# EasyEDA Pro project ax08.eprj, board mem
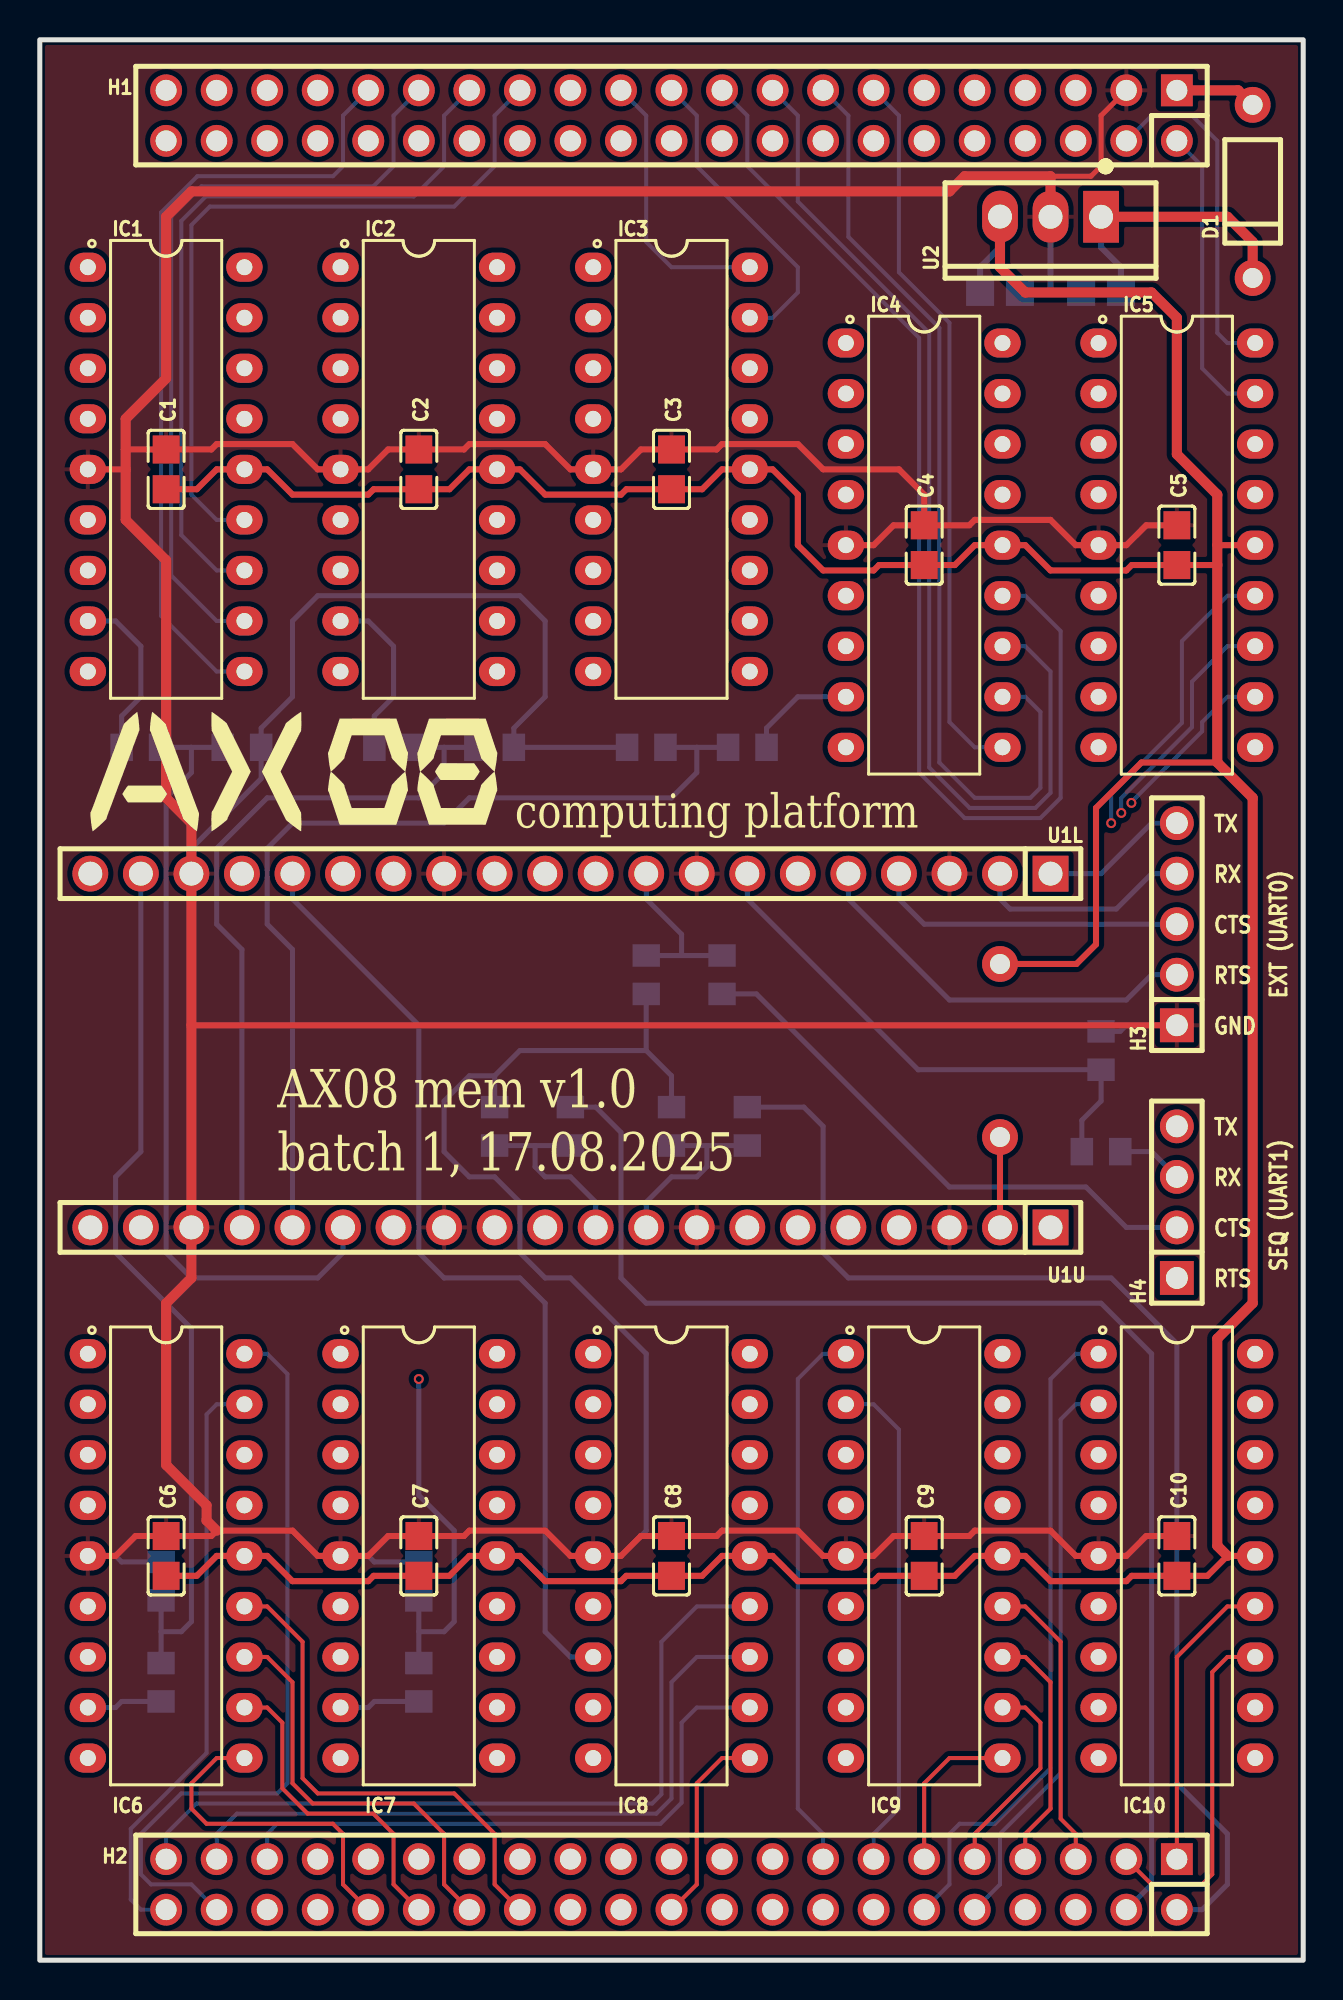
[diagram p41: board, top side]
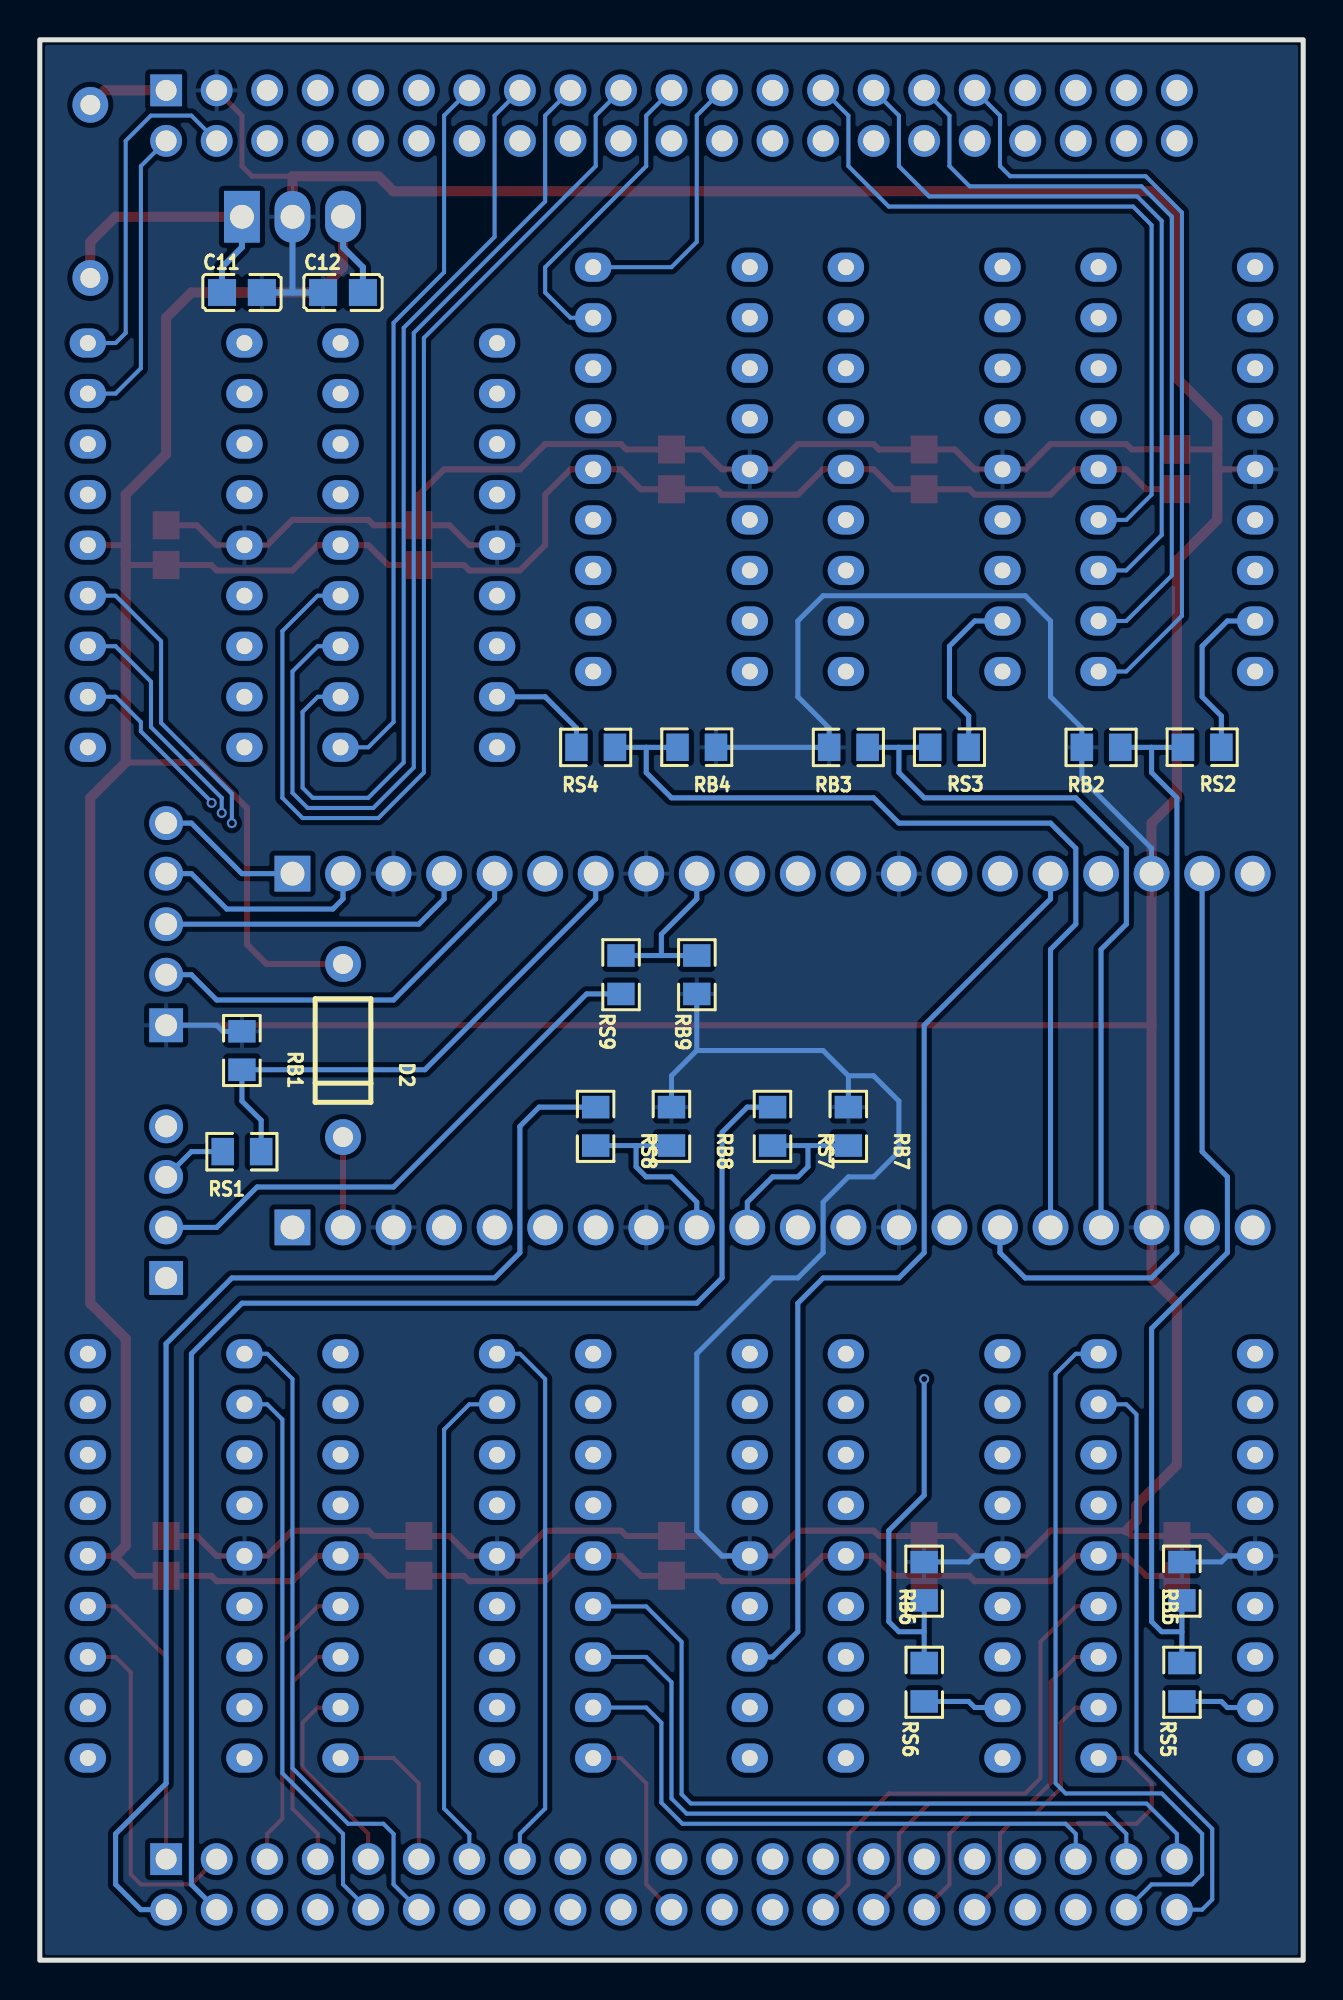
[diagram p42: board, bottom side, seen from below]

Outline 63.5 x 96.52 mm; copper layers: Top Layer, Inner1, Inner2, Bottom Layer. Coordinates in mm from the lower left corner of the outline.
Outline path: rectangle 0,96.52 63.5,0
Stack: Top Layer 0.035mm Outer layer thickness 1oz / Dielectric1 0.2104mm 7628 RC49% 8.6mil / Inner1 0.0152mm Inner layer thickness / Dielectric2 1.065mm 1.1mm H/HOZ Copper / Inner2 0.0152mm Inner layer thickness / Dielectric3 0.2104mm 7628 RC49% 8.6mil / Bottom Layer 0.035mm Outer layer thickness 1oz

## Design rules (mm)
template: JLCPCB Capability(Two Layers Board)
spacing copperThickness1oz (default): track to track 0.102, other pairs 0.152 to 0.3
spacing copperThickness2oz: track to track 0.203, other pairs 0.152 to 0.3
track width copperThickness1oz (default): min 0.127, default 0.254, max 2.54
track width copperThickness2oz: min 0.203, default 0.254, max 2.54
differential pair differentialPair (default): width min 0.127, default 0.254, max 2.54; gap min 0.152, default 0.152
via viaSize (default): diameter min 0.5, default 0.61, max 10; hole min 0.3, default 0.305, max 6.3

## Placement (name value [footprint] x y rotation side)
C1  100nF  [C0805]  6.35 74.93 90 top
C2  100nF  [C0805]  19.05 74.93 90 top
C3  100nF  [C0805]  31.75 74.93 90 top
C4  100nF  [C0805]  44.45 71.12 90 top
C5  100nF  [C0805]  57.15 71.12 90 top
C6  100nF  [C0805]  6.35 20.32 90 top
C7  100nF  [C0805]  19.05 20.32 90 top
C8  100nF  [C0805]  31.75 20.32 90 top
C9  100nF  [C0805]  44.45 20.32 90 top
C10  100nF  [C0805]  57.15 20.32 90 top
C11  100nF  [C0805]  53.34 83.82 180 bottom
C12  100nF  [C0805]  48.26 83.82 180 bottom
D1  1N5819  [DO-41_BD2.4-L4.7-P8.70-D0.9-RD]  60.96 88.9 90 top
D2  1N5819  [DO-41_BD2.4-L4.7-P8.70-D0.9-RD]  48.26 45.72 90 bottom
H1  FH-00008  [HDR-TH_42P-P2.54-V-F-R2-C21-S2.54-1]  31.75 92.71 180 top
H2  FH-00008  [HDR-TH_42P-P2.54-V-F-R2-C21-S2.54-1]  31.75 3.81 180 top
H3  PZ254V-11-05P  [HDR-TH_5P-P2.54-V-M]  57.15 52.07 90 top
H4  PZ254V-11-04P  [HDR-TH_4P-P2.54-V-M]  57.15 38.1 90 top
IC1  PIC16F1847-I/P  [PDIP-18_L22.9-W6.4-P2.54-LS7.9-BL]  6.35 74.93 270 top
IC2  PIC16F1847-I/P  [PDIP-18_L22.9-W6.4-P2.54-LS7.9-BL]  19.05 74.93 270 top
IC3  PIC16F1847-I/P  [PDIP-18_L22.9-W6.4-P2.54-LS7.9-BL]  31.75 74.93 270 top
IC4  PIC16F1847-I/P  [PDIP-18_L22.9-W6.4-P2.54-LS7.9-BL]  44.45 71.12 270 top
IC5  PIC16F1847-I/P  [PDIP-18_L22.9-W6.4-P2.54-LS7.9-BL]  57.15 71.12 270 top
IC6  PIC16F1847-I/P  [PDIP-18_L22.9-W6.4-P2.54-LS7.9-BL]  6.35 20.32 270 top
IC7  PIC16F1847-I/P  [PDIP-18_L22.9-W6.4-P2.54-LS7.9-BL]  19.05 20.32 270 top
IC8  PIC16F1847-I/P  [PDIP-18_L22.9-W6.4-P2.54-LS7.9-BL]  31.75 20.32 270 top
IC9  PIC16F1847-I/P  [PDIP-18_L22.9-W6.4-P2.54-LS7.9-BL]  44.45 20.32 270 top
IC10  PIC16F1847-I/P  [PDIP-18_L22.9-W6.4-P2.54-LS7.9-BL]  57.15 20.32 270 top
RB1  6k8  [R0805_1]  53.34 45.72 270 bottom
RB2  6k8  [R0805_1]  10.16 60.96 180 bottom
RB3  6k8  [R0805_1]  22.86 60.96 180 bottom
RB4  6k8  [R0805_1]  30.48 60.96 0 bottom
RB5  6k8  [R0805_1]  6.1 19.05 270 bottom
RB6  6k8  [R0805_1]  19.05 19.05 270 bottom
RB7  6k8  [R0805_1]  22.86 41.91 270 bottom
RB8  6k8  [R0805_1]  31.75 41.91 270 bottom
RB9  6k8  [R0805_1]  30.48 49.53 90 bottom
RS1  3k3  [R0805_1]  53.34 40.64 180 bottom
RS2  3k3  [R0805_1]  5.08 60.96 0 bottom
RS3  3k3  [R0805_1]  17.78 60.96 0 bottom
RS4  3k3  [R0805_1]  35.56 60.96 180 bottom
RS5  3k3  [R0805_1]  6.1 13.97 90 bottom
RS6  3k3  [R0805_1]  19.05 13.97 90 bottom
RS7  3k3  [R0805_1]  26.67 41.91 270 bottom
RS8  3k3  [R0805_1]  35.56 41.91 270 bottom
RS9  3k3  [R0805_1]  34.29 49.53 90 bottom
U1L  PM2.54-1*20  [HDR-TH_20P-P2.54-V-F]  26.67 54.61 180 top
U1U  PM2.54-1*20  [HDR-TH_20P-P2.54-V-F]  26.67 36.83 180 top
U2  L7805CV  [TO-220-3_L10.0-W4.5-P2.54-L]  50.8 87.63 180 top

## Footprints (pads in the part's own frame, mm; a bottom-side part is the same pattern mirrored in y, then rotated)
C0805
  rect 1.41x1.35 smd: 1(-1,0) 2(1,0)
DO-41_BD2.4-L4.7-P8.70-D0.9-RD
  round 1.8 hole 1: 1(-4.35,0) 2(4.35,0)
HDR-TH_4P-P2.54-V-M
  rect 1.7x1.7 hole 1.1: 1(-3.81,0)
  round 1.7 hole 1.1: 2(-1.27,0) 3(1.27,0) 4(3.81,0)
HDR-TH_5P-P2.54-V-M
  rect 1.7x1.7 hole 1.1: 1(-5.08,0)
  round 1.7 hole 1.1: 2(-2.54,0) 3(0,0) 4(2.54,0) 5(5.08,0)
HDR-TH_20P-P2.54-V-F
  rect 1.8x1.8 hole 1.2: 1(-24.13,0)
  round 1.8 hole 1.2: 2(-21.59,0) 3(-19.05,0) 4(-16.51,0) 5(-13.97,0) 6(-11.43,0) 7(-8.89,0) 8(-6.35,0) 9(-3.81,0) 10(-1.27,0) 11(1.27,0) 12(3.81,0) 13(6.35,0) 14(8.89,0) 15(11.43,0) 16(13.97,0) 17(16.51,0) 18(19.05,0) 19(21.59,0) 20(24.13,0)
HDR-TH_42P-P2.54-V-F-R2-C21-S2.54-1
  rect 1.6x1.6 hole 1.05: 1(-25.4,-1.27)
  round 1.6 hole 1.05: 2(-25.4,1.27) 3(-22.86,-1.27) 4(-22.86,1.27) 5(-20.32,-1.27) 6(-20.32,1.27) 7(-17.78,-1.27) 8(-17.78,1.27) 9(-15.24,-1.27) 10(-15.24,1.27) 11(-12.7,-1.27) 12(-12.7,1.27) 13(-10.16,-1.27) 14(-10.16,1.27) 15(-7.62,-1.27) 16(-7.62,1.27) 17(-5.08,-1.27) 18(-5.08,1.27) 19(-2.54,-1.27) 20(-2.54,1.27) 21(0,-1.27) 22(0,1.27) 23(2.54,-1.27) 24(2.54,1.27) 25(5.08,-1.27) 26(5.08,1.27) 27(7.62,-1.27) 28(7.62,1.27) 29(10.16,-1.27) 30(10.16,1.27) 31(12.7,-1.27) 32(12.7,1.27) 33(15.24,-1.27) 34(15.24,1.27) 35(17.78,-1.27) 36(17.78,1.27) 37(20.32,-1.27) 38(20.32,1.27) 39(22.86,-1.27) 40(22.86,1.27) 41(25.4,-1.27) 42(25.4,1.27)
PDIP-18_L22.9-W6.4-P2.54-LS7.9-BL
  oval 1.462x1.827 hole 0.8: 1(-10.16,-3.935) 2(-7.62,-3.935) 3(-5.08,-3.935) 4(-2.54,-3.935) 5(0,-3.935) 6(2.54,-3.935) 7(5.08,-3.935) 8(7.62,-3.935) 9(10.16,-3.935) 10(10.16,3.935) 11(7.62,3.935) 12(5.08,3.935) 13(2.54,3.935) 14(0,3.935) 15(-2.54,3.935) 16(-5.08,3.935) 17(-7.62,3.935) 18(-10.16,3.935)
R0805_1
  rect 1.133x1.377 smd: 1(-0.966,0) 2(0.966,0)
TO-220-3_L10.0-W4.5-P2.54-L
  rect 1.8x2.6 hole 1.2: 1(-2.54,0.005)
  oval 1.8x2.6 hole 1.2: 2(0,0.005) 3(2.54,-0.005)

## Nets
As in the schematic.

Pads without a net: IC1 3 4 6 7 9 15 16; IC2 3 4 6 7 9 15 16; IC3 3 4 6 8 9 15 16; IC4 3 4 6 7 9 15 16; IC5 3 4 6 8 9 15 16; IC6 3 4 6 7 9 15 16; IC7 3 4 6 7 9 15 16; IC8 3 4 6 8 9 15 16; IC9 3 4 6 8 9 15 16; IC10 3 4 6 8 9 15 16; U1L 11 12; U1U 1 4 5 6 7 11 12 19 20

## Via types
v1: diameter 0.5, hole 0.3, Top Layer to Bottom Layer, 4 vias

## Routing (per net, layer and track width the routed paths; a pad name or vN(x,y) marks a point on that pad's centre or on a via; arc(x,y) is an arc through that point)
+5V: length 222
  Top Layer w0.305: C1.1 7.89,73.93 8.89,74.93 IC1.14 11.43,74.93 12.7,73.66 16.51,73.66 16.78,73.93 C2.1 20.59,73.93 21.59,74.93 IC2.14 24.13,74.93 25.4,73.66 29.21,73.66 29.48,73.93 C3.1 33.29,73.93 34.29,74.93 IC3.14 36.83,74.93 38.1,73.66 38.1,71.12 39.37,69.85 41.91,69.85 42.18,70.12 C4.1 45.99,70.12 46.99,71.12 IC4.14 49.53,71.12 50.8,69.85 54.61,69.85 54.88,70.12 C5.1 59.18,70.12 ; D2.2 52.1,50.07 53.09,51.05 53.09,57.91 55.37,60.2 59.18,60.2 ; C6.1 7.89,19.32 8.89,20.32 IC6.14 11.43,20.32 12.7,19.05 16.51,19.05 16.78,19.32 C7.1 20.59,19.32 21.59,20.32 IC7.14 24.13,20.32 25.4,19.05 29.21,19.05 29.48,19.32 C8.1 33.29,19.32 34.29,20.32 IC8.14 36.83,20.32 38.1,19.05 41.91,19.05 42.18,19.32 C9.1 45.99,19.32 46.99,20.32 IC9.14 49.53,20.32 50.8,19.05 54.61,19.05 54.88,19.32 C10.1 58.69,19.32 59.69,20.32 IC10.14 ; IC5.14 59.18,71.12
  Top Layer w0.508: U2.3 48.26,85.09 49.53,83.82 55.88,83.82 57.15,82.55 57.15,75.69 59.18,73.66 59.18,60.2 60.96,58.42 60.96,33.02 59.18,31.24 59.18,20.83 59.69,20.32
  Bottom Layer w0.305: U2.3 48.26,86.09 47.26,85.09 C12.2
GND: length 407.5
  Top Layer w0.254: H1.3 53.34,92.71 53.34,90.17 52.83,89.66 50.8,89.66
  Top Layer w0.305: H3.1 7.62,46.99 ; IC6.5 3.81,20.32 4.81,21.32 C6.2 8.62,21.32 8.89,21.59 12.7,21.59 13.97,20.32 IC7.5 16.51,20.32 17.51,21.32 C7.2 21.32,21.32 21.59,21.59 25.4,21.59 26.67,20.32 29.21,20.32 30.21,21.32 C8.2 34.02,21.32 34.29,21.59 38.1,21.59 39.37,20.32 IC9.5 41.91,20.32 42.91,21.32 C9.2 46.72,21.32 46.99,21.59 50.8,21.59 52.07,20.32 IC10.5 54.61,20.32 55.61,21.32 C10.2 ; C4.2 42.91,72.12 41.91,71.12 IC4.5 ; C4.2 46.72,72.12 46.99,72.39 50.8,72.39 52.07,71.12 IC5.5 54.61,71.12 55.61,72.12 C5.2 ; C4.2 44.45,73.66 43.18,74.93 39.37,74.93 38.1,76.2 34.29,76.2 34.02,75.93 C3.2 30.21,75.93 29.21,74.93 26.67,74.93 25.4,76.2 21.59,76.2 21.32,75.93 C2.2 17.51,75.93 16.51,74.93 IC2.5 13.97,74.93 12.7,76.2 8.89,76.2 8.62,75.93 C1.2 4.32,75.93 ; IC1.5 4.32,74.93
  Top Layer w0.508: 8.89,21.59 8.38,22.1 8.38,22.86 6.35,24.89 6.35,33.02 7.62,34.29 U1U.18 U1L.18 7.62,57.15 6.35,58.42 6.35,70.36 4.32,72.39 4.32,77.47 6.35,79.5 6.35,87.63 7.62,88.9 45.72,88.9 46.48,89.66 50.8,89.66 U2.2
  Bottom Layer w0.254: RB8.1 31.75,44.45 30.48,45.72 ; H3.1 54.61,46.99 54.31,46.69 RB1.1 ; RB9.1 30.48,45.72 ; 30.48,45.72 24.13,45.72 22.86,44.45 ; RB7.1 22.86,44.45 ; 22.86,44.45 21.59,44.45 20.32,43.18 20.32,40.64 21.59,39.37 22.86,39.37 24.13,38.1 24.13,35.56 25.4,34.29 26.67,34.29 30.48,30.48 30.48,21.59 29.21,20.32 27.82,20.32 ; RB5.1 4.11,20.02 3.81,20.32 IC6.5 ; U1L.18 7.62,55.88 11.13,59.39 RB2.1 11.13,61.93 12.7,63.5 12.7,67.31 13.97,68.58 24.13,68.58 25.4,67.31 25.4,63.5 23.83,61.93 RB3.1 RB4.1 ; RB6.1 16.81,20.02 16.51,20.32 IC7.5
  Bottom Layer w0.305: U2.2 50.8,83.82 ; 50.8,83.82 C12.1 ; 50.8,83.82 C11.2
VCC: length 4.1
  Top Layer w0.508: H1.1 60.23,93.98 D1.2
A0: length 11.1
  Inner1 w0.254: H1.28 24.13,90.17 25.4,88.9 25.4,83.82 24.13,82.55 IC2.17
A1: length 8.8
  Inner1 w0.203: IC2.18 21.59,85.09 20.32,86.36 20.32,88.9 21.59,90.17 H1.30
A2: length 9.5
  Inner1 w0.203: H1.32 19.05,86.36 17.78,85.09 IC2.1
A3: length 12.1
  Inner1 w0.203: H1.34 16.51,90.17 12.7,86.36 12.7,83.82 13.97,82.55 IC2.2
A4: length 33.7
  Inner2 w0.203: IC2.10 21.59,64.77 20.32,66.04 20.32,73.91
  Inner2 w0.254: 20.32,73.91 20.32,88.05 18.71,89.66 14.48,89.66 13.97,90.17 H1.36
A5: length 46.5
  Inner2 w0.203: H1.38 11.43,90.17 12.45,89.15 18.5,89.15 19.81,87.84 19.81,64.01 21.59,62.23 24.38,62.23 24.89,62.74 24.89,66.55 24.13,67.31 IC2.11
A6: length 52.9
  Inner2 w0.203: IC2.12 24.13,69.85 25.4,68.58 25.4,62.48 24.64,61.72 21.34,61.72 19.3,63.75 19.3,87.63 18.29,88.65 10.41,88.65 8.89,90.17 H1.40
A7: length 59.3
  Inner2 w0.203: H1.42 6.35,90.17 8.38,88.14 18.08,88.14 18.8,87.42 18.8,63.5 21.08,61.21 24.89,61.21 25.91,62.23 25.91,70.61 24.13,72.39 IC2.13
AD_RGC0: length 30.5
  Bottom Layer w0.203: H2.37 11.43,6.35 11.94,6.86 31.2,6.86 32.26,7.92 32.26,11.94 33.02,12.7 IC8.11
AD_RGC1: length 35.2
  Bottom Layer w0.203: IC8.12 33.02,15.24 31.75,13.97 31.75,8.13 30.99,7.37 9.91,7.37 8.89,6.35 H2.39
AD_RGC2: length 39.8
  Bottom Layer w0.203: H2.41 6.35,6.35 7.87,7.87 30.78,7.87 31.24,8.34 31.24,16 33.02,17.78 IC8.13
B0: length 18.5
  Inner2 w0.203: H1.41 3.81,93.98 2.54,92.71 2.54,88.9 8.89,82.55 IC1.17
B1: length 16
  Inner2 w0.203: H1.39 7.62,92.71 5.08,92.71 3.81,91.44 3.81,90.17 8.89,85.09 IC1.18
B2: length 14.2
  Inner1 w0.203: H1.37 10.16,92.71 10.16,90.17 5.08,85.09 IC1.1
B3: length 17.8
  Inner1 w0.203: IC1.2 5.08,82.55 12.7,90.17 12.7,92.71 H1.35
B4: length 40.1
  Bottom Layer w0.203: H1.33 15.24,92.71 15.24,90.17 14.73,89.66 7.92,89.66 6.1,87.84 6.1,67.56 8.89,64.77 IC1.10
B5: length 39.2
  Bottom Layer w0.203: H1.31 17.78,92.71 17.78,90.17 16.76,89.15 8.13,89.15 6.6,87.63 6.6,69.6 8.89,67.31 IC1.11
B6: length 38.4
  Bottom Layer w0.203: IC1.12 8.89,69.85 7.11,71.63 7.11,87.42 8.34,88.65 18.8,88.65 20.32,90.17 20.32,92.71 H1.29
B7: length 37.5
  Bottom Layer w0.203: H1.27 22.86,92.71 22.86,90.17 20.83,88.14 8.55,88.14 7.62,87.21 7.62,73.66 8.89,72.39 IC1.13
CTS_EXT: length 15.8
  Bottom Layer w0.254: H3.3 44.45,52.07 43.18,53.34 U1L.4
CTS_SEQ: length 8.7
  Bottom Layer w0.254: 32.26,50.5 32.26,51.56 30.48,53.34 U1L.9 ; 32.26,50.5 RB9.2 ; 32.26,50.5 RS9.2
HOLD: length 61.5
  Bottom Layer w0.254: RS8.1 38.4,42.88 39.37,41.91 39.37,35.56 40.64,34.29 53.85,34.29 57.15,30.99 57.15,8.89 59.69,6.35 59.69,3.81 58.42,2.54 H2.2
MEMOUT0: length 15.1
  Bottom Layer w0.203: IC5.17 59.69,78.74 58.42,80.01 58.42,90.17 H1.2
MEMOUT1: length 17.4
  Bottom Layer w0.203: IC5.18 59.69,81.28 59.18,81.79 59.18,91.44 57.91,92.71 55.88,92.71 H1.4
MEMOUT2: length 14.1
  Inner1 w0.203: IC5.1 54.61,81.28 55.88,82.55 55.88,88.39 54.61,89.66 53.85,89.66 H1.6
MEMOUT3: length 20.9
  Inner1 w0.203: IC5.2 52.07,78.74 50.8,80.01 46.99,80.01 46.23,80.77 46.23,88.65 47.24,89.66 49.02,89.66 49.53,90.17 H1.8
MEMOUT4: length 49.3
  Inner1 w0.203: H1.10 46.74,91.19 46.74,90.17 45.77,89.2 45.77,59.09 46.18,58.67 55.88,58.67 58.17,60.96 IC5.10
MEMOUT5: length 51.5
  Inner1 w0.203: H1.12 44.45,89.66 45.21,88.9 45.21,58.93 45.97,58.17 v1(54.86,58.17)
  Bottom Layer w0.203: v1(54.86,58.17) 54.86,58.21 58.42,61.77 58.42,62.23 59.69,63.5 IC5.11
MEMOUT6: length 56
  Inner1 w0.203: H1.14 41.91,90.17 44.7,87.38 44.7,58.72 45.76,57.66 v1(54.36,57.66)
  Bottom Layer w0.203: v1(54.36,57.66) 54.36,58.42 57.91,61.98 57.91,64.26 59.69,66.04 IC5.12
MEMOUT7: length 60.4
  Inner1 w0.203: v1(53.85,57.15) 45.55,57.15 44.2,58.51 44.2,85.34 39.37,90.17 H1.16
  Bottom Layer w0.203: IC5.13 59.69,68.58 57.4,66.29 57.4,62.19 53.85,58.63 v1(53.85,57.15)
MODEA: length 29.6
  Inner1 w0.203: H2.24 30.48,3.81 30.48,6.35 32.26,8.13 32.26,27.18 33.02,27.94 IC8.17
MODEB: length 33.2
  Inner1 w0.203: IC8.18 33.02,30.48 31.75,29.21 31.75,10.16 27.94,6.35 27.94,3.81 H2.26
NOT_OPCD_10101: length 67.1
  Bottom Layer w0.254: RS7.1 27.94,42.88 29.21,41.61 29.21,34.29 30.48,33.02 53.34,33.02 55.88,30.48 55.88,3.81 H2.4
OP_CD0: length 15.7
  Bottom Layer w0.203: H1.21 33.02,92.71 33.02,90.17 38.1,85.09 38.1,83.82 36.83,82.55 IC3.17
OP_CD1: length 13.9
  Bottom Layer w0.203: IC3.18 31.75,85.09 30.48,86.36 30.48,92.71 H1.23
OP_CD2: length 12.4
  Inner1 w0.203: 27.82,85.09 29.21,85.09 30.48,86.36 30.48,87.63 27.94,90.17 27.94,92.71 H1.25
PAGE0: length 24
  Inner2 w0.203: H1.5 53.34,92.71 55.37,92.71 55.88,92.2 55.88,81.28 54.61,80.01 50.8,80.01 49.53,78.74 IC4.17
PAGE1: length 22.6
  Inner2 w0.203: H1.7 50.8,92.71 50.8,90.17 51.31,89.66 54.61,89.66 55.37,88.9 55.37,83.82 54.1,82.55 50.8,82.55 49.53,81.28 IC4.18
PAGE2: length 16.2
  Inner2 w0.203: IC4.1 41.91,81.28 43.18,82.55 43.18,87.63 45.72,90.17 45.72,92.71 H1.9
PAGE3: length 19.5
  Inner2 w0.203: IC4.2 39.37,78.74 38.1,80.01 38.1,83.82 43.18,88.9 43.18,92.71 H1.11
PAGE4: length 36.5
  Bottom Layer w0.203: IC4.10 46.99,60.96 45.72,62.23 45.72,82.3 43.18,84.84 43.18,92.71 H1.13
PAGE5: length 48.3
  Bottom Layer w0.203: H1.15 40.64,92.71 40.64,86.61 45.21,82.04 45.21,60.2 46.99,58.42 49.78,58.42 50.29,58.93 50.29,62.74 49.53,63.5 IC4.11
PAGE6: length 53.6
  Bottom Layer w0.203: IC4.12 49.53,66.04 50.8,64.77 50.8,58.67 50.04,57.91 46.74,57.91 44.7,59.94 44.7,81.79 38.1,88.39 38.1,92.71 H1.17
PAGE7: length 58.9
  Bottom Layer w0.203: H1.19 35.56,92.71 35.56,90.17 44.2,81.53 44.2,59.69 46.48,57.4 50.29,57.4 51.31,58.42 51.31,66.8 49.53,68.58 IC4.13
PC_B0: length 30.1
  Bottom Layer w0.203: H2.42 5.08,2.54 4.57,3.05 4.57,6.6 8.38,10.41 8.38,27.43 8.89,27.94 IC6.17
PC_B1: length 38.2
  Bottom Layer w0.203: IC6.18 11.43,30.48 12.45,29.46 12.45,8.89 11.94,8.38 7.11,8.38 5.08,6.35 5.08,4.32 5.59,3.81 7.62,3.81 H2.40
PC_B2: length 33.2
  Inner2 w0.203: H2.38 10.16,3.81 10.16,6.35 6.35,10.16 6.35,29.21 5.08,30.48 IC6.1
PC_B3: length 35.2
  Inner1 w0.203: H2.36 12.7,3.81 5.59,3.81 5.08,4.32 5.08,26.67 3.81,27.94 IC6.2
PC_B4: length 16.9
  Top Layer w0.203: H2.34 15.24,3.81 15.24,6.35 14.73,6.86 8.38,6.86 7.62,7.62 7.62,8.89 8.89,10.16 IC6.10
PC_B5: length 16.4
  Top Layer w0.203: IC6.11 11.43,12.7 12.19,11.94 12.19,8.64 13.46,7.37 16.76,7.37 17.78,6.35 17.78,3.81 H2.32
PC_B6: length 21
  Top Layer w0.203: H2.30 20.32,3.81 20.32,6.35 18.8,7.87 13.72,7.87 12.7,8.89 12.7,13.97 11.43,15.24 IC6.12
PC_B7: length 25.7
  Top Layer w0.203: H2.28 22.86,3.81 22.86,6.35 20.83,8.38 13.97,8.38 13.21,9.14 13.21,16 11.43,17.78 IC6.13
PC_B8: length 47.7
  Inner2 w0.203: IC7.17 24.13,27.94 25.4,29.21 25.4,31.75 23.62,33.53 13.72,33.53 12.19,32 12.19,8.13 13.97,6.35 H2.35
PC_B9: length 41.2
  Inner2 w0.203: IC7.18 21.59,30.48 19.05,33.02 13.97,33.02 12.7,31.75 12.7,8.38 13.72,7.37 15.49,7.37 16.51,6.35 H2.33
PC_B10: length 31.4
  Inner2 w0.203: H2.31 19.05,6.35 17.53,7.87 13.97,7.87 13.21,8.64 13.21,29.72 13.97,30.48 IC7.1
PC_B11: length 26.4
  Inner2 w0.203: IC7.2 16.51,27.94 17.78,26.67 17.78,10.16 21.59,6.35 H2.29
PC_B12: length 7.9
  Inner2 w0.203: IC7.10 21.59,10.16 21.08,9.65 21.08,8.13 H2.27
PC_B13: length 9.8
  Inner2 w0.203: IC7.11 24.13,12.7 24.89,11.94 24.89,8.13 26.67,6.35 H2.25
PC_B14: length 14.5
  Inner2 w0.203: H2.23 29.21,6.35 28.7,6.86 26.92,6.86 25.4,8.38 25.4,13.97 24.13,15.24 IC7.12
PC_B15: length 19.1
  Inner2 w0.203: H2.21 31.75,6.35 30.73,7.37 27.18,7.37 25.91,8.64 25.91,16 24.13,17.78 IC7.13
RTS_EXT: length 20.4
  Bottom Layer w0.254: U1L.5 40.64,53.34 45.72,48.26 54.61,48.26 55.88,49.53 H3.2
RTS_SEQ: length 41.3
  Inner1 w0.254: H4.1 55.88,34.29 54.61,35.56 54.61,40.64 50.8,44.45 36.83,44.45 27.94,53.34 U1L.10
RX_EXT: length 11.1
  Bottom Layer w0.254: U1L.2 48.26,53.34 48.77,52.83 54.1,52.83 55.88,54.61 H3.4
RX_MEM: length 60.2
  Inner2 w0.254: U1U.14 17.78,48.26 21.59,52.07 21.59,55.88 22.86,57.15 49.53,57.15 50.8,58.42 50.8,64.77 52.07,66.04 IC5.7
RX_SEQ: length 27.1
  Bottom Layer w0.254: RS1.2 52.37,42.21 53.34,43.18 RB1.2 44.15,44.75 35.56,53.34 U1L.7
RX_WD0: length 71.6
  Inner2 w0.254: U1L.14 17.78,52.07 16.51,50.8 16.51,35.56 17.4,34.67 28.83,34.67 29.97,33.53 44.45,33.53 45.72,32.26 45.72,16.51 44.45,15.24 IC9.7
RX_WD1: length 72.6
  Inner1 w0.254: IC10.7 54.61,15.24 57.15,17.78 57.15,30.48 54.61,33.02 52.07,33.02 50.8,34.29 30.48,34.29 29.21,35.56 29.21,39.37 15.24,53.34 U1L.15
RX_WD2: length 48.5
  Bottom Layer w0.254: U1L.16 12.7,53.34 19.05,46.99 19.05,35.56 20.32,34.29 24.13,34.29 25.4,33.02 25.4,16.51 26.67,15.24 27.82,15.24
RX_WD3: length 36
  Inner1 w0.254: U1L.17 10.16,57.15 11.43,58.42 29.21,58.42 30.48,59.69 30.48,68.58 29.21,69.85 27.82,69.85
TX_A: length 37
  Bottom Layer w0.254: 20.32,60.96 20.32,59.69 19.05,58.42 11.43,58.42 8.89,55.88 8.89,52.07 10.16,50.8 U1U.17 ; 20.32,60.96 RS3.2 ; 20.32,60.96 RB3.2
TX_B: length 40.3
  Bottom Layer w0.254: 7.62,60.96 7.62,59.69 6.35,58.42 6.35,35.56 7.62,34.29 13.97,34.29 15.24,35.56 U1U.15 ; 7.62,60.96 RS2.2 ; 7.62,60.96 RB2.2
TX_EXT: length 7.4
  Bottom Layer w0.254: U1L.1 53.34,54.61 55.88,57.15 H3.5
TX_PAGE: length 47.2
  Bottom Layer w0.254: RB4.2 33.02,60.96 ; 33.02,60.96 RS4.2 ; 33.02,60.96 33.02,59.69 31.75,58.42 21.59,58.42 20.32,57.15 12.7,57.15 11.43,55.88 11.43,52.07 12.7,50.8 U1U.16
TX_PC0: length 44.6
  Bottom Layer w0.254: 6.1,16.51 RB5.2 ; 6.1,16.51 RS5.2 ; 6.1,16.51 7.11,16.51 7.62,17.02 7.62,31.75 3.81,35.56 3.81,39.37 5.08,40.64 U1L.19
TX_PC1: length 50.3
  Inner1 w0.254: v1(19.05,29.21) 19.05,30.48 13.97,35.56 13.97,40.64 2.54,52.07 U1L.20
  Bottom Layer w0.254: 19.05,16.51 20.32,16.51 20.83,17.02 20.83,21.59 19.05,23.37 v1(19.05,29.21) ; 19.05,16.51 RS6.2 ; 19.05,16.51 RB6.2
TX_SEQ: length 25.8
  Inner1 w0.254: U1L.6 38.1,53.34 44.45,46.99 53.34,46.99 57.15,43.18 H4.4
WD_A0: length 47.5
  Inner1 w0.203: IC9.17 49.53,27.94 50.8,29.21 50.8,31.75 49.53,33.02 39.37,33.02 38.1,31.75 38.1,10.16 34.29,6.35 H2.19
WD_A1: length 34.7
  Inner1 w0.203: H2.17 36.83,6.35 38.1,7.62 43.18,7.62 44.45,8.89 44.45,29.21 45.72,30.48 IC9.18
WD_A2: length 27.6
  Bottom Layer w0.203: IC9.1 39.37,30.48 38.1,29.21 38.1,7.62 39.37,6.35 H2.15
WD_A3: length 25.3
  Bottom Layer w0.203: IC9.2 41.91,27.94 43.18,26.67 43.18,7.62 41.91,6.35 H2.13
WD_A4: length 8.3
  Top Layer w0.203: IC9.10 45.72,10.16 44.45,8.89 H2.11
WD_A5: length 10.4
  Top Layer w0.203: IC9.11 49.53,12.7 50.29,11.94 50.29,9.65 46.99,6.35 H2.9
WD_A6: length 12.4
  Top Layer w0.203: IC9.12 49.53,15.24 50.8,13.97 50.8,7.62 49.53,6.35 H2.7
WD_A7: length 14.9
  Top Layer w0.203: IC9.13 49.53,17.78 51.31,16 51.31,7.11 52.07,6.35 H2.5
WD_B0: length 44.1
  Inner2 w0.254: IC10.17 57.15,27.94 55.88,26.67 55.88,8.89 54.61,7.62 41.91,7.62 40.64,6.35 40.64,3.81 H2.16
WD_B1: length 41.9
  Inner1 w0.203: IC10.18 59.69,30.48 58.42,29.21 58.42,12.7 52.58,6.86 43.69,6.86 43.18,6.35 43.18,3.81 H2.14
WD_B2: length 33.3
  Bottom Layer w0.203: IC10.1 52.07,30.48 50.8,29.21 50.8,9.65 48.01,6.86 46.23,6.86 45.72,6.35 45.72,3.81 H2.12
WD_B3: length 28.6
  Bottom Layer w0.203: H2.10 48.26,3.81 48.26,6.35 51.31,9.4 51.31,27.18 52.07,27.94 IC10.2
WD_B4: length 15.9
  Inner1 w0.203: H2.8 50.8,3.81 52.83,3.81 53.34,4.32 53.34,6.35 57.15,10.16 IC10.10
WD_B5: length 17.7
  Inner2 w0.254: H2.6 53.34,3.81 58.42,3.81 58.93,4.32 58.93,11.94 59.69,12.7 IC10.11
WD_B6: length 17.7
  Top Layer w0.203: IC10.12 59.69,15.24 58.93,14.48 58.93,4.32 58.42,3.81 55.88,3.81 H2.3
WD_B7: length 15.1
  Top Layer w0.203: H2.1 57.15,15.24 59.69,17.78 IC10.13
WD_OP0: length 13.4
  Inner1 w0.203: H1.18 36.83,90.17 29.21,82.55 27.82,82.55
WD_OP1: length 29.1
  Inner2 w0.203: IC3.10 34.29,64.77 33.02,66.04 33.02,88.9 34.29,90.17 H1.20
WD_OP2: length 39.8
  Inner2 w0.203: H1.22 31.75,89.66 32.51,88.9 32.51,64.01 34.29,62.23 37.08,62.23 37.59,62.74 37.59,66.55 36.83,67.31 IC3.11
WD_OP3: length 45.1
  Inner2 w0.203: H1.24 29.21,90.17 32,87.38 32,63.75 34.04,61.72 37.34,61.72 38.1,62.48 38.1,68.58 36.83,69.85 IC3.12
WD_OP4: length 50.5
  Inner2 w0.203: IC3.13 36.83,72.39 38.61,70.61 38.61,62.23 37.59,61.21 33.78,61.21 31.5,63.5 31.5,85.34 26.67,90.17 H1.26
WD_OUT0: length 32.5
  Inner2 w0.203: H2.18 35.56,3.81 35.56,6.35 30.99,10.92 30.99,28.7 29.21,30.48 27.82,30.48
WD_OUT1: length 28.9
  Inner2 w0.203: H2.20 33.02,3.81 33.02,6.35 30.48,8.89 30.48,26.67 29.21,27.94 27.82,27.94
WD_OUT2: length 10.1
  Top Layer w0.203: H2.22 33.02,3.81 33.02,8.89 34.29,10.16 IC8.10
$1N5488: length 14.2
  Top Layer w0.508: D1.1 60.96,86.36 59.7,87.62 U2.1
  Bottom Layer w0.305: U2.1 53.34,86.09 54.34,85.09 C11.1
$1N7638: length 4.5
  Top Layer w0.305: U1U.2 D2.1
$1N9234: length 8.7
  Bottom Layer w0.254: IC1.8 3.81,67.31 5.08,66.04 5.08,63.5 4.11,62.53 RS2.1
$1N9380: length 3.4
  Bottom Layer w0.254: H4.3 55.88,40.64 RS1.1
$1N9577: length 8.7
  Bottom Layer w0.254: RS3.1 16.81,62.53 17.78,63.5 17.78,66.04 16.51,67.31 IC2.8
$1N9646: length 5.6
  Bottom Layer w0.254: IC4.8 38.1,63.5 36.53,61.93 RS4.1
$1N9715: length 3.8
  Bottom Layer w0.254: RS5.1 4.11,13 3.81,12.7 IC6.8
$1N9784: length 4.1
  Bottom Layer w0.254: IC7.8 16.51,12.7 16.81,13 RS6.1
$1N10036: length 9.9
  Bottom Layer w0.254: U1U.10 27.94,38.1 26.67,39.37 25.4,39.37 24.89,39.88 24.89,40.94 ; 24.89,40.94 RS7.2 ; 24.89,40.94 RB7.2
$1N10052: length 9.9
  Bottom Layer w0.254: U1U.9 30.48,38.1 31.75,39.37 33.02,39.37 33.53,39.88 33.53,40.94 ; 33.53,40.94 RS8.2 ; 33.53,40.94 RB8.2
$1N11627: length 27.7
  Bottom Layer w0.254: H4.2 54.61,36.83 52.58,38.86 45.72,38.86 36.02,48.56 RS9.1

## Copper pours and planes (outline as drawn; the poured copper is in the pictures)
GND on Top Layer: 0,96.52 63.5,96.52 63.5,0 0,0
GND on Bottom Layer: 0,96.52 63.5,96.52 63.5,0 0,0
GND on Inner1: 0,96.52 63.5,96.52 63.5,0 0,0
GND on Inner2: 0,96.52 63.5,96.52 63.5,0 0,0

## Text on the board
Top Silkscreen Layer: TX | RX | CTS | RTS | GND | EXT (UART0) | SEQ (UART1) | computing platform | AX08 mem v1.0 / batch 1, 17.08.2025
